# Altium schematic sheet Signalni_dio.SchDoc
size A4
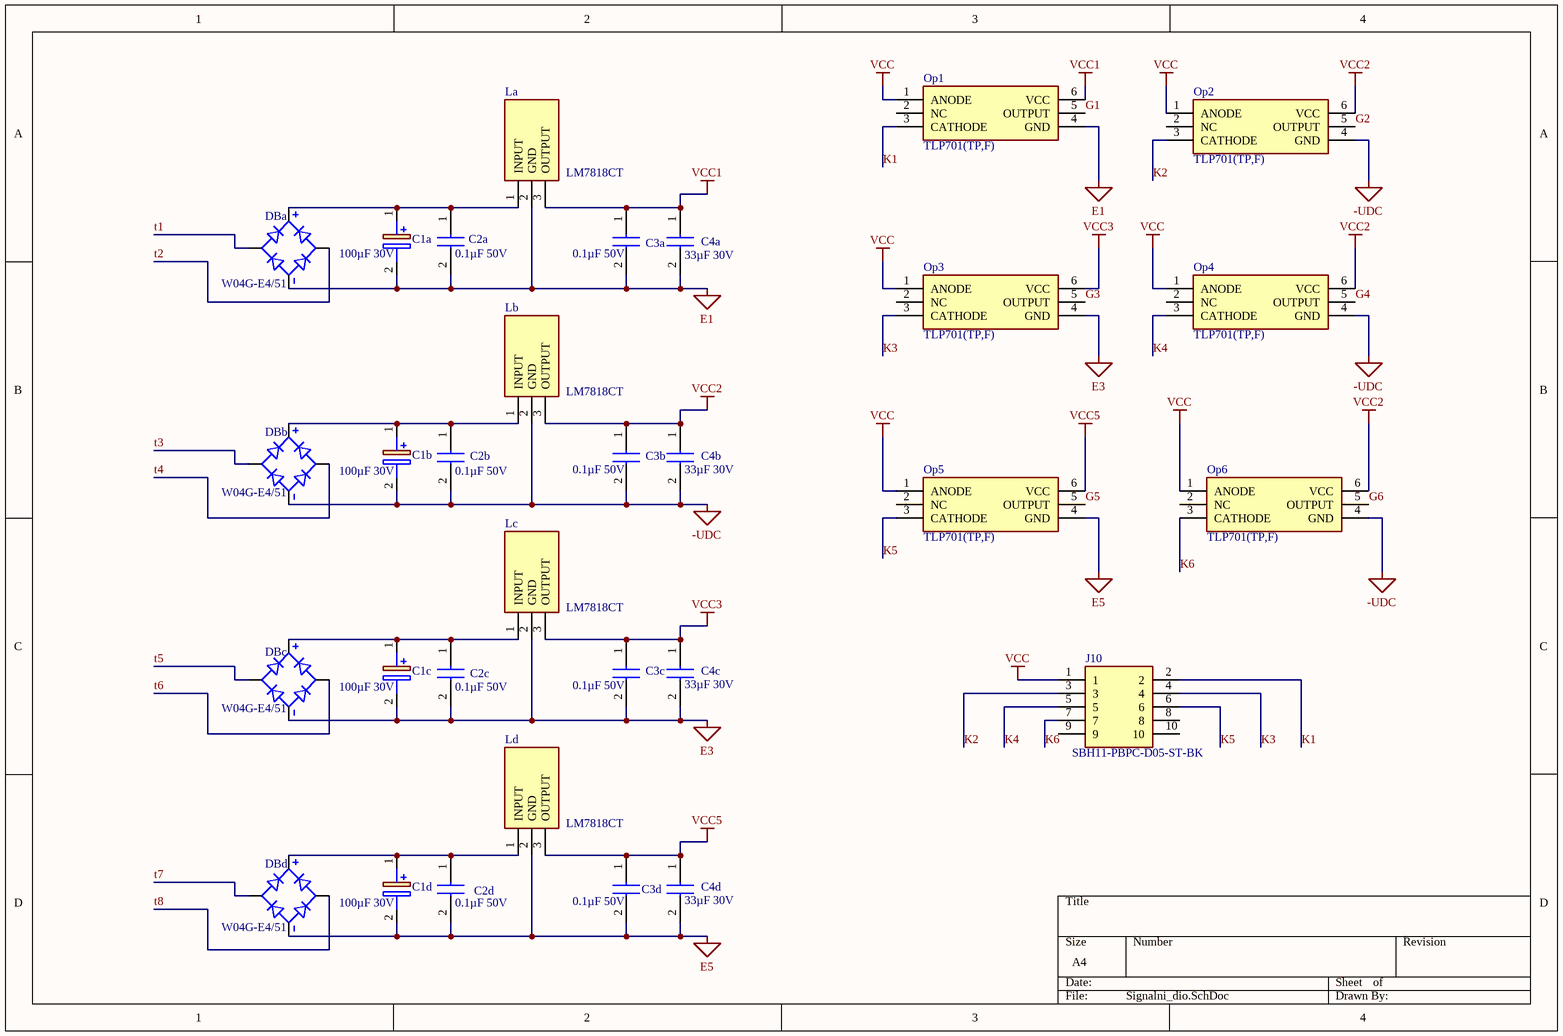
[diagram p0: Signalni_dio.SchDoc]

## Parts
C1a  100µF 30V  [20]
C1b  100µF 30V  [20]
C1c  100µF 30V  [20]
C1d  100µF 30V  [20]
C2a  0.1µF 50V  [8]
C2b  0.1µF 50V  [8]
C2c  0.1µF 50V  [8]
C2d  0.1µF 50V  [8]
C3a  0.1µF 50V  [8]
C3b  0.1µF 50V  [8]
C3c  0.1µF 50V  [8]
C3d  0.1µF 50V  [8]
C4a  33µF 30V  [CAPPRD200W50D500H1250]
C4b  33µF 30V  [CAPPRD200W50D500H1250]
C4c  33µF 30V  [CAPPRD200W50D500H1250]
C4d  33µF 30V  [CAPPRD200W50D500H1250]
DBa  W04G-E4/51  [11]
DBb  W04G-E4/51  [11]
DBc  W04G-E4/51  [11]
DBd  W04G-E4/51  [11]
J10  SBH11-PBPC-D05-ST-BK  [4]
La  LM7818CT  [9]
Lb  LM7818CT  [9]
Lc  LM7818CT  [9]
Ld  LM7818CT  [9]
Op1  TLP701(TP,F)  [1]
Op2  TLP701(TP,F)  [1]
Op3  TLP701(TP,F)  [1]
Op4  TLP701(TP,F)  [1]
Op5  TLP701(TP,F)  [1]
Op6  TLP701(TP,F)  [1]

## Nets
-UDC: C1b.2(-) C2b.2(-) C3b.2(-) C4b.2(-) DBb.NEG Lb.2(GND) Op2.4(GND) Op4.4(GND) Op6.4(GND)
E1: C1a.2(-) C2a.2(-) C3a.2(-) C4a.2(-) DBa.NEG La.2(GND) Op1.4(GND)
E3: C1c.2(-) C2c.2(-) C3c.2(-) C4c.2(-) DBc.NEG Lc.2(GND) Op3.4(GND)
E5: C1d.2(-) C2d.2(-) C3d.2(-) C4d.2(-) DBd.NEG Ld.2(GND) Op5.4(GND)
VCC: J10.1 Op1.1(ANODE) Op2.1(ANODE) Op3.1(ANODE) Op4.1(ANODE) Op5.1(ANODE) Op6.1(ANODE)
VCC1: C3a.1(+) C4a.1(+) La.3(OUTPUT) Op1.6(VCC)
VCC2: C3b.1(+) C4b.1(+) Lb.3(OUTPUT) Op2.6(VCC) Op4.6(VCC) Op6.6(VCC)
VCC3: C3c.1(+) C4c.1(+) Lc.3(OUTPUT) Op3.6(VCC)
VCC5: C3d.1(+) C4d.1(+) Ld.3(OUTPUT) Op5.6(VCC)
G1: Op1.5(OUTPUT)
G2: Op2.5(OUTPUT)
G3: Op3.5(OUTPUT)
G4: Op4.5(OUTPUT)
G5: Op5.5(OUTPUT)
G6: Op6.5(OUTPUT)
K1: J10.2 Op1.3(CATHODE)
K2: J10.3 Op2.3(CATHODE)
K3: J10.4 Op3.3(CATHODE)
K4: J10.5 Op4.3(CATHODE)
K5: J10.6 Op5.3(CATHODE)
K6: J10.7 Op6.3(CATHODE)
t1: DBa.AC2
t2: DBa.AC1
t3: DBb.AC2
t4: DBb.AC1
t5: DBc.AC2
t6: DBc.AC1
t7: DBd.AC2
t8: DBd.AC1
NetC1a_1: C1a.1(+) C2a.1(+) DBa.POS La.1(INPUT)
NetC1b_1: C1b.1(+) C2b.1(+) DBb.POS Lb.1(INPUT)
NetC1c_1: C1c.1(+) C2c.1(+) DBc.POS Lc.1(INPUT)
NetC1d_1: C1d.1(+) C2d.1(+) DBd.POS Ld.1(INPUT)

Not connected (* = marked no-connect by the designer): J10 8 9 10; Op1 2(NC); Op2 2(NC); Op3 2(NC); Op4 2(NC); Op5 2(NC); Op6 2(NC)

## Library data of the parts
C1a C1b C1c C1d = ESK107M035AE3AA: Capacitor Polarised; Manufacturer_Name: KEMET; Datasheet Link: https://content.kemet.com/datasheets/KEM_A4004_ESK.pdf; Height: 12.5mm; Manufacturer_Part_Number: ESK107M035AE3AA; Mouser Part Number: 80-ESK107M035AE3AA; Mouser Price/Stock: https://www.mouser.co.uk/ProductDetail/KEMET/ESK107M035AE3AA?qs=907G%252Bm7SbTtznNeWXOh3WA%3D%3D; Arrow Part Number: ESK107M035AE3AA; Arrow Price/Stock: https://www.arrow.com/en/products/esk107m035ae3aa/kemet-corporation
C2a C2b C2c C2d = K104Z15Y5VF5TL2: Capacitor; Manufacturer_Name: Vishay; Datasheet Link: http://www.mouser.com/ds/2/427/mkseries-205465.pdf; Manufacturer_Part_Number: K104Z15Y5VF5TL2; Mouser Part Number: 594-K104Z15Y5VF5TL2; Mouser Price/Stock: https://www.mouser.co.uk/ProductDetail/Vishay-BC-Components/K104Z15Y5VF5TL2?qs=8fb2TFeI5qG%252BXNQE4bq55w%3D%3D; Arrow Part Number: K104Z15Y5VF5TL2; Arrow Price/Stock: https://www.arrow.com/en/products/k104z15y5vf5tl2/vishay?region=nac
C3a C3b C3c C3d = K104Z15Y5VF5TL2_1: Capacitor; Manufacturer_Name: Vishay; Datasheet Link: http://www.mouser.com/ds/2/427/mkseries-205465.pdf; Manufacturer_Part_Number: K104Z15Y5VF5TL2; Mouser Part Number: 594-K104Z15Y5VF5TL2; Mouser Price/Stock: https://www.mouser.co.uk/ProductDetail/Vishay-BC-Components/K104Z15Y5VF5TL2?qs=8fb2TFeI5qG%252BXNQE4bq55w%3D%3D; Arrow Part Number: K104Z15Y5VF5TL2; Arrow Price/Stock: https://www.arrow.com/en/products/k104z15y5vf5tl2/vishay?region=nac
C4a C4b C4c C4d = ESH336M035AC3AA: Capacitor; Manufacturer_Name: KEMET; Datasheet Link: https://content.kemet.com/datasheets/KEM_A4005_ESH.pdf; Height: 12.5mm; Manufacturer_Part_Number: ESH336M035AC3AA; Mouser Part Number: 80-ESH336M035AC3AA; Mouser Price/Stock: https://www.mouser.co.uk/ProductDetail/KEMET/ESH336M035AC3AA?qs=w9hhVRgtvflENp8Xu64Lcw%3D%3D; Arrow Part Number: ESH336M035AC3AA; Arrow Price/Stock: https://www.arrow.com/en/products/esh336m035ac3aa/kemet-corporation?region=nac
DBa DBb DBc DBd = W04G-E4/51: Bridge Rectifier Single Phase Standard 400 V Through Hole WOG; MF: Vishay; Value: *; SnapEDA_Link: https://www.snapeda.com/parts/W04G-E4/51/Vishay+Semiconductor+Diodes+Division/view-part/?ref=snap; Purchase-URL: https://pricing.snapeda.com/search/part/W04G-E4/51/?ref=eda; Availability: In Stock; Price: None; Package: WOG-4 Vishay Semiconductor Diodes Division; Check_prices: https://www.snapeda.com/parts/W04G-E4/51/Vishay+Semiconductor+Diodes+Division/view-part/?ref=eda; MP: W04G-E4/51
J10 = SBH11-PBPC-D05-ST-BK: Connector; Manufacturer_Name: Sullins; Datasheet Link: https://s3.amazonaws.com/catalogspreads-pdf/PAGE122%20.100%20SBH11%20SERIES%20MALE%20BOX%20HDR%20ST%20RA%20SMT.pdf; Height: 8.8mm; Manufacturer_Part_Number: SBH11-PBPC-D05-ST-BK
La Lb Lc Ld = LM7818CT: Integrated Circuit; Manufacturer_Name: onsemi; Datasheet Link: https://componentsearchengine.com/Datasheets/2/LM7818CT.pdf; Height: 4.7mm; Manufacturer_Part_Number: LM7818CT; Mouser Part Number: 512-LM7818CT; Mouser Price/Stock: https://www.mouser.co.uk/ProductDetail/ON-Semiconductor-Fairchild/LM7818CT?qs=VOMQJJE%252BBNlJ%252BsI8cCErUA%3D%3D; Arrow Part Number: LM7818CT; Arrow Price/Stock: https://www.arrow.com/en/products/lm7818ct/on-semiconductor
Op1-Op6 = TLP701_TP_: Phototransistor; Manufacturer_Name: Toshiba; Manufacturer_Part_Number: TLP701(TP); Datasheet Link: https://toshiba.semicon-storage.com/info/docget.jsp?did=1642&prodName=TLP701; Height: 4.25mm